# Altium schematic sheet Landing-AW1.SchDoc
size B; SheetNumber: 1; SheetTotal: 5
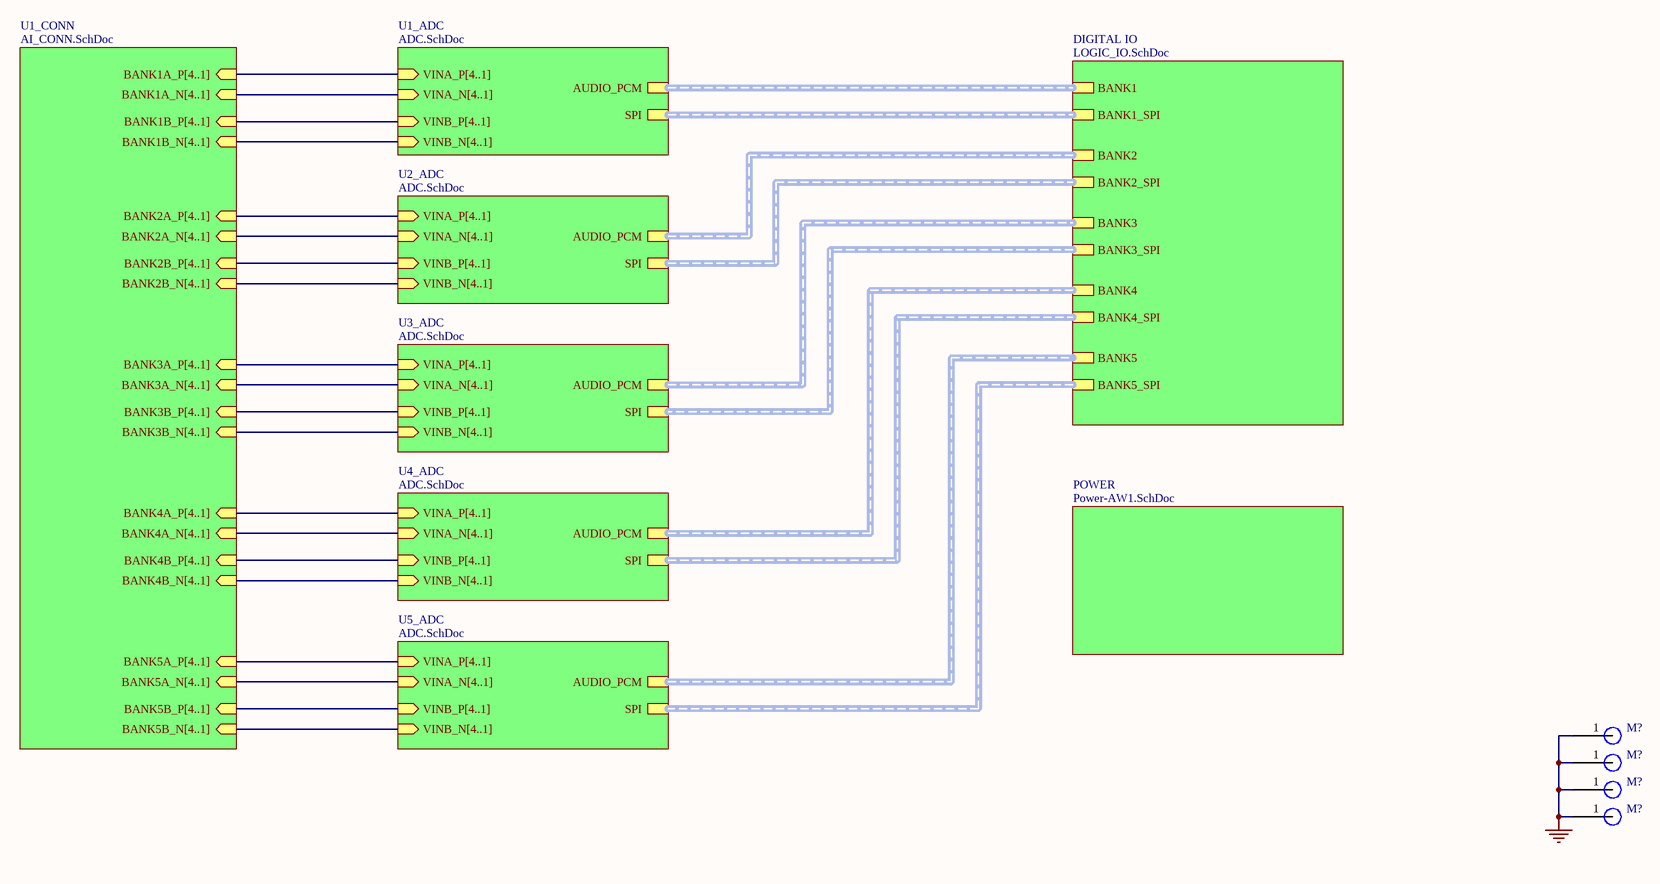
[diagram p0: Landing-AW1.SchDoc]

## Parts
(Parts that share a designator on the sheet are numbered #1, #2 ... from top to bottom, then left to right.)
M?#1  MNT_HOLE  [TP-PTH-65/100]  (value not drawn)
M?#2  MNT_HOLE  [TP-PTH-65/100]  (value not drawn)
M?#3  MNT_HOLE  [TP-PTH-65/100]  (value not drawn)
M?#4  MNT_HOLE  [TP-PTH-65/100]  (value not drawn)

## Sub-sheets
DIGITAL IO = LOGIC_IO.SchDoc: BANK1 (harness PCM_AUDIO_H), BANK2 (harness PCM_AUDIO_H), BANK3 (harness PCM_AUDIO_H), BANK1_SPI (harness PCM_SPI_CONFIG_H), BANK2_SPI (harness PCM_SPI_CONFIG_H), BANK3_SPI (harness PCM_SPI_CONFIG_H), BANK4 (harness PCM_AUDIO_H), BANK5 (harness PCM_AUDIO_H), BANK4_SPI (harness PCM_SPI_CONFIG_H), BANK5_SPI (harness PCM_SPI_CONFIG_H)
POWER = Power-AW1.SchDoc: no entries
U1_ADC = ADC.SchDoc: AUDIO_PCM (harness PCM_AUDIO_H), SPI (harness PCM_SPI_CONFIG_H), VINA_P[4..1] (in), VINA_N[4..1] (in), VINB_N[4..1] (in), VINB_P[4..1] (in)
U1_CONN = AI_CONN.SchDoc: BANK1A_P[4..1] (in), BANK1A_N[4..1] (in), BANK2A_P[4..1] (in), BANK2A_N[4..1] (in), BANK1B_P[4..1] (in), BANK1B_N[4..1] (in), BANK2B_P[4..1] (in), BANK2B_N[4..1] (in), BANK3A_P[4..1] (in), BANK3A_N[4..1] (in), BANK3B_P[4..1] (in), BANK3B_N[4..1] (in), BANK4A_P[4..1] (in), BANK4A_N[4..1] (in), BANK4B_P[4..1] (in), BANK4B_N[4..1] (in), BANK5A_P[4..1] (in), BANK5A_N[4..1] (in), BANK5B_P[4..1] (in), BANK5B_N[4..1] (in)
U2_ADC = ADC.SchDoc: AUDIO_PCM (harness PCM_AUDIO_H), SPI (harness PCM_SPI_CONFIG_H), VINA_P[4..1] (in), VINA_N[4..1] (in), VINB_N[4..1] (in), VINB_P[4..1] (in)
U3_ADC = ADC.SchDoc: AUDIO_PCM (harness PCM_AUDIO_H), SPI (harness PCM_SPI_CONFIG_H), VINA_P[4..1] (in), VINA_N[4..1] (in), VINB_N[4..1] (in), VINB_P[4..1] (in)
U4_ADC = ADC.SchDoc: AUDIO_PCM (harness PCM_AUDIO_H), SPI (harness PCM_SPI_CONFIG_H), VINA_P[4..1] (in), VINA_N[4..1] (in), VINB_N[4..1] (in), VINB_P[4..1] (in)
U5_ADC = ADC.SchDoc: AUDIO_PCM (harness PCM_AUDIO_H), SPI (harness PCM_SPI_CONFIG_H), VINA_P[4..1] (in), VINA_N[4..1] (in), VINB_N[4..1] (in), VINB_P[4..1] (in)

## Nets
GND: M?#1.1 M?#2.1 M?#3.1 M?#4.1

## Buses and harness runs
bus sheet U1_ADC/VINA_N[4..1] = sheet U1_CONN/BANK1A_N[4..1]
bus sheet U1_ADC/VINA_P[4..1] = sheet U1_CONN/BANK1A_P[4..1]
bus sheet U1_ADC/VINB_N[4..1] = sheet U1_CONN/BANK1B_N[4..1]
bus sheet U1_ADC/VINB_P[4..1] = sheet U1_CONN/BANK1B_P[4..1]
bus sheet U1_CONN/BANK2A_N[4..1] = sheet U2_ADC/VINA_N[4..1]
bus sheet U1_CONN/BANK2A_P[4..1] = sheet U2_ADC/VINA_P[4..1]
bus sheet U1_CONN/BANK2B_N[4..1] = sheet U2_ADC/VINB_N[4..1]
bus sheet U1_CONN/BANK2B_P[4..1] = sheet U2_ADC/VINB_P[4..1]
bus sheet U1_CONN/BANK3A_N[4..1] = sheet U3_ADC/VINA_N[4..1]
bus sheet U1_CONN/BANK3A_P[4..1] = sheet U3_ADC/VINA_P[4..1]
bus sheet U1_CONN/BANK3B_N[4..1] = sheet U3_ADC/VINB_N[4..1]
bus sheet U1_CONN/BANK3B_P[4..1] = sheet U3_ADC/VINB_P[4..1]
bus sheet U1_CONN/BANK4A_N[4..1] = sheet U4_ADC/VINA_N[4..1]
bus sheet U1_CONN/BANK4A_P[4..1] = sheet U4_ADC/VINA_P[4..1]
bus sheet U1_CONN/BANK4B_N[4..1] = sheet U4_ADC/VINB_N[4..1]
bus sheet U1_CONN/BANK4B_P[4..1] = sheet U4_ADC/VINB_P[4..1]
bus sheet U1_CONN/BANK5A_N[4..1] = sheet U5_ADC/VINA_N[4..1]
bus sheet U1_CONN/BANK5A_P[4..1] = sheet U5_ADC/VINA_P[4..1]
bus sheet U1_CONN/BANK5B_N[4..1] = sheet U5_ADC/VINB_N[4..1]
bus sheet U1_CONN/BANK5B_P[4..1] = sheet U5_ADC/VINB_P[4..1]
harness sheet DIGITAL IO/BANK1 = sheet U1_ADC/AUDIO_PCM
harness sheet DIGITAL IO/BANK1_SPI = sheet U1_ADC/SPI
harness sheet DIGITAL IO/BANK2 = sheet U2_ADC/AUDIO_PCM
harness sheet DIGITAL IO/BANK2_SPI = sheet U2_ADC/SPI
harness sheet DIGITAL IO/BANK3 = sheet U3_ADC/AUDIO_PCM
harness sheet DIGITAL IO/BANK3_SPI = sheet U3_ADC/SPI
harness sheet DIGITAL IO/BANK4 = sheet U4_ADC/AUDIO_PCM
harness sheet DIGITAL IO/BANK4_SPI = sheet U4_ADC/SPI
harness sheet DIGITAL IO/BANK5 = sheet U5_ADC/AUDIO_PCM
harness sheet DIGITAL IO/BANK5_SPI = sheet U5_ADC/SPI